# Altium schematic sheet 3_Memory.SchDoc
size A4; SheetNumber: 3; SheetTotal: 7
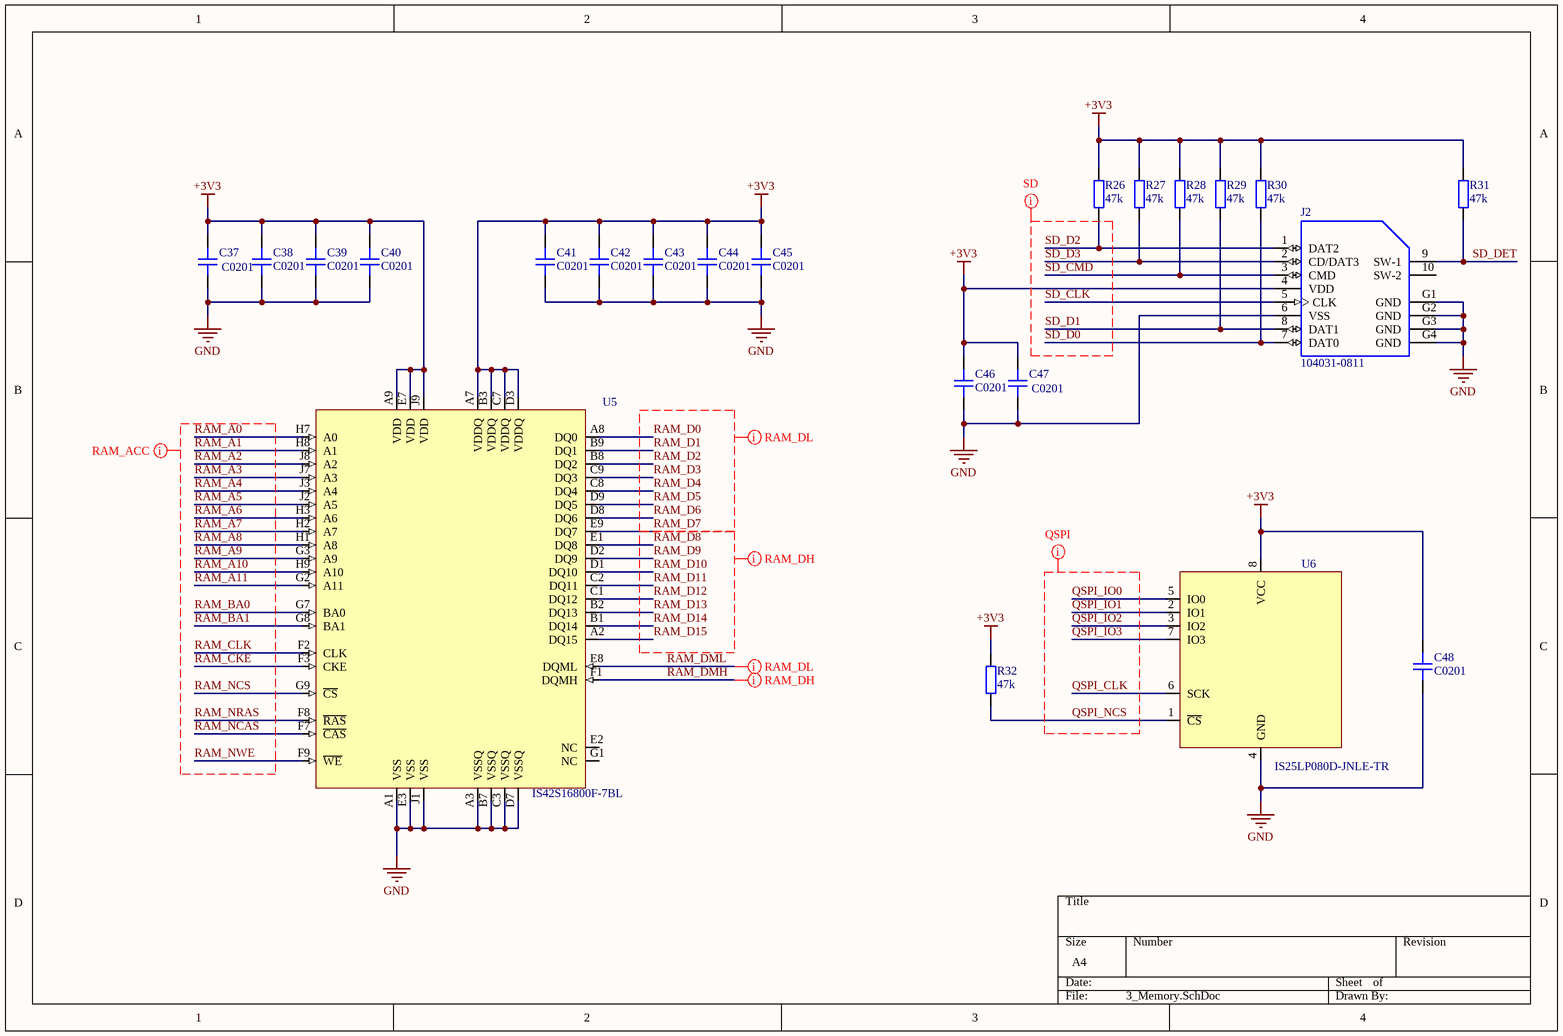
[diagram p0: 3_Memory.SchDoc]

## Parts
C37  C0201  [CAP_0201]
C38  C0201  [CAP_0201]
C39  C0201  [CAP_0201]
C40  C0201  [CAP_0201]
C41  C0201  [CAP_0201]
C42  C0201  [CAP_0201]
C43  C0201  [CAP_0201]
C44  C0201  [CAP_0201]
C45  C0201  [CAP_0201]
C46  C0201  [CAP_0201]
C47  C0201  [CAP_0201]
C48  C0201  [CAP_0201]
J2  104031-0811  [104031-0811]
R26  47k  [RES_0402]
R27  47k  [RES_0402]
R28  47k  [RES_0402]
R29  47k  [RES_0402]
R30  47k  [RES_0402]
R31  47k  [RES_0402]
R32  47k  [RES_0402]
U5  IS42S16800F-7BL  [BGA54C80P9X9_800X800X120]
U6  IS25LP080D-JNLE-TR  [SOIC-8]

## Nets
+3V3: C37.2 C38.2 C39.2 C40.2 C41.2 C42.2 C43.2 C44.2 C45.2 C46.2 C47.2 C48.2 J2.4(VDD) R26.2 R27.2 R28.2 R29.2 R30.2 R31.2 R32.2 U5.A7(VDDQ) U5.A9(VDD) U5.B3(VDDQ) U5.C7(VDDQ) U5.D3(VDDQ) U5.E7(VDD) U5.J9(VDD) U6.8(VCC)
GND: C37.1 C38.1 C39.1 C40.1 C41.1 C42.1 C43.1 C44.1 C45.1 C46.1 C47.1 C48.1 J2.6(VSS) J2.G1(GND) J2.G2(GND) J2.G3(GND) J2.G4(GND) U5.A1(VSS) U5.A3(VSSQ) U5.B7(VSSQ) U5.C3(VSSQ) U5.D7(VSSQ) U5.E3(VSS) U5.J1(VSS) U6.4(GND)
QSPI_CLK: U6.6(SCK)
QSPI_IO0: U6.5(IO0)
QSPI_IO1: U6.2(IO1)
QSPI_IO2: U6.3(IO2)
QSPI_IO3: U6.7(IO3)
QSPI_NCS: R32.1 U6.1(~{CS})
RAM_A0: U5.H7(A0)
RAM_A1: U5.H8(A1)
RAM_A2: U5.J8(A2)
RAM_A3: U5.J7(A3)
RAM_A4: U5.J3(A4)
RAM_A5: U5.J2(A5)
RAM_A6: U5.H3(A6)
RAM_A7: U5.H2(A7)
RAM_A8: U5.H1(A8)
RAM_A9: U5.G3(A9)
RAM_A10: U5.H9(A10)
RAM_A11: U5.G2(A11)
RAM_BA0: U5.G7(BA0)
RAM_BA1: U5.G8(BA1)
RAM_CKE: U5.F3(CKE)
RAM_CLK: U5.F2(CLK)
RAM_D0: U5.A8(DQ0)
RAM_D1: U5.B9(DQ1)
RAM_D2: U5.B8(DQ2)
RAM_D3: U5.C9(DQ3)
RAM_D4: U5.C8(DQ4)
RAM_D5: U5.D9(DQ5)
RAM_D6: U5.D8(DQ6)
RAM_D7: U5.E9(DQ7)
RAM_D8: U5.E1(DQ8)
RAM_D9: U5.D2(DQ9)
RAM_D10: U5.D1(DQ10)
RAM_D11: U5.C2(DQ11)
RAM_D12: U5.C1(DQ12)
RAM_D13: U5.B2(DQ13)
RAM_D14: U5.B1(DQ14)
RAM_D15: U5.A2(DQ15)
RAM_DMH: U5.F1(DQMH)
RAM_DML: U5.E8(DQML)
RAM_NCAS: U5.F7(~{CAS})
RAM_NCS: U5.G9(~{CS})
RAM_NRAS: U5.F8(~{RAS})
RAM_NWE: U5.F9(~{WE})
SD_CLK: J2.5(CLK)
SD_CMD: J2.3(CMD) R28.1
SD_D0: J2.7(DAT0) R30.1
SD_D1: J2.8(DAT1) R29.1
SD_D2: J2.1(DAT2) R26.1
SD_D3: J2.2(CD/DAT3) R27.1
SD_DET: J2.9(SW-1) R31.1

Not connected (* = marked no-connect by the designer): J2 10(SW-2); U5 E2(NC) G1(NC)

## Layout directives
net class RAM_DL: RAM_D0, RAM_D1, RAM_D2, RAM_D3, RAM_D4, RAM_D5, RAM_D6, RAM_D7, RAM_DML
net class RAM_DH: RAM_D7, RAM_D8, RAM_D9, RAM_D10, RAM_D11, RAM_D12, RAM_D13, RAM_D14, RAM_D15, RAM_DMH
net class RAM_ACC: RAM_A0, RAM_A1, RAM_A2, RAM_A3, RAM_A4, RAM_A5, RAM_A6, RAM_A7, RAM_A8, RAM_A9, RAM_A10, RAM_A11, RAM_BA0, RAM_BA1, RAM_CKE, RAM_CLK, RAM_NCAS, RAM_NCS, RAM_NRAS, RAM_NWE
net class QSPI: QSPI_CLK, QSPI_IO0, QSPI_IO1, QSPI_IO2, QSPI_IO3, QSPI_NCS
net class SD: SD_CLK, SD_CMD, SD_D0, SD_D1, SD_D2, SD_D3

## Library data of the parts
C37-C48 = CAP_0201: Capacitor SMD 0201; Manufacturer: *; Manufacturer Part Number: *; Distributor Link: *; LCSC: *; Rating: *; Dielectric: *
R26-R32 = RES_0402: Resistor SMD 0402; Manufacturer: *; Manufacturer Part Number: *; Distributor Link: *; LCSC: *
U5 = IS42S16800F-*B: SDRAM 128Mbit 8Mx16 143Mhz 3.3V 54-ball BGA; Manufacturer: ISSI; Manufacturer Part Number: IS42S16800F-*B*
U6 = IS25LP080D-JNLE-TR: QSPI NOR Flash Memory 8 Mbit SOIC-8; Manufacturer: ISSI; Manufacturer Part Number: IS25LP080D-JNLE-TR